# EAGLE design mLampMine (EAGLE 7.2.0)
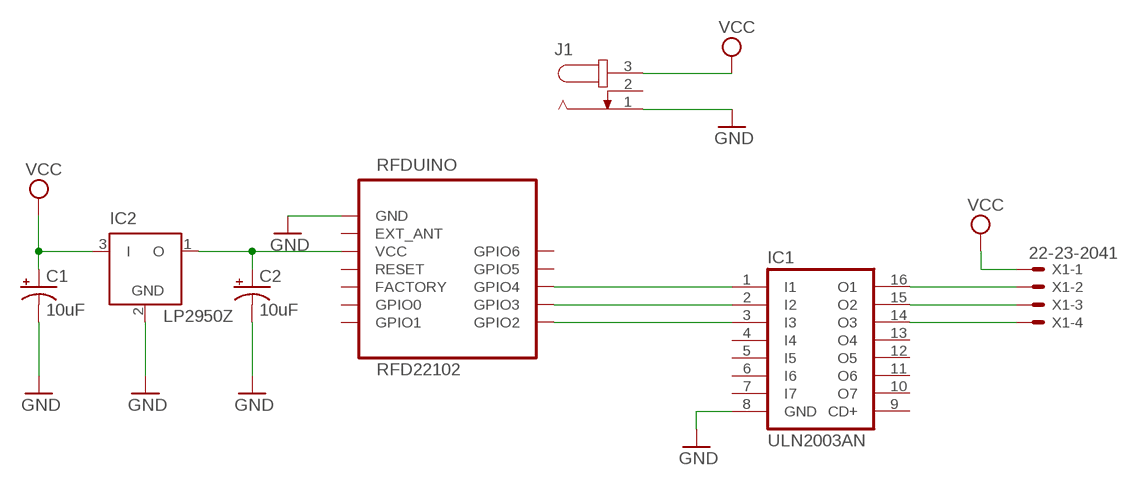
[diagram p0: schematic, sheet 1]

## Parts
C1  10uF  CAP_POLPTH2  [CPOL-RADIAL-10UF-25V]
C2  10uF  CAP_POLPTH2  [CPOL-RADIAL-10UF-25V]
IC1  ULN2003AN  [DIL16]
IC2  LP2950Z  [TO92]
J1  JACK-PLUG0  [SPC4077]
RFDUINO  RFD22102  [RFD22102]
X1  22-23-2041  [22-23-2041]

## Nets
GND: C1.2(-) C2.2(-) IC1.8(GND) IC2.2(GND) J1.1 RFDUINO.GND
N$1: IC1.2(I2) RFDUINO.GPIO3
N$2: IC1.1(I1) RFDUINO.GPIO4
N$3: IC1.3(I3) RFDUINO.GPIO2
N$4: C2.1(+) IC2.1(O) RFDUINO.VCC
N$5: IC1.14(O3) X1.4
N$6: IC1.15(O2) X1.3
N$7: IC1.16(O1) X1.2
VCC: C1.1(+) IC2.3(I) J1.3 X1.1
Unconnected: IC1.4(I4) IC1.5(I5) IC1.6(I6) IC1.7(I7) IC1.9(CD+) IC1.10(O7) IC1.11(O6) IC1.12(O5) IC1.13(O4) J1.2 RFDUINO.EXT_ANT RFDUINO.FACTORY RFDUINO.GPIO0 RFDUINO.GPIO1 RFDUINO.GPIO5 RFDUINO.GPIO6 RFDUINO.RESET

## Library data of the parts
C1 C2 = SparkFun-Capacitors:CAP_POL: Capacitor Polarized These are standard SMD and PTH capacitors. Normally 10uF, 47uF, and 100uF in electrolytic and tantalum varieties. Always verify the external diameter of the through hole cap, it varies with capacity, voltage, and manufacturer. The EIA devices should be standard.
IC1 = uln-udn:ULN2003A: DRIVER ARRAY
IC2 = linear:LP2950: 100 mA, Low Power Low Dropout Voltage Regulator Source: http://www.onsemi.com/pub/Collateral/LP2950-D.PDF
J1 = con-jack:JACK-PLUG: DC POWER JACK Power Jack, DC, Right Angle, Through Hole, Rated 5A at 16VDC, PC Terminals Distributor: Farnell (www.Farnell.de) Drawing: 84N1161.pdf / 84N1162.pdf Manufacturer: SPC Technology (www.spctechnology.com) Type: SPC4077 / SPC 4078; OC_FARNELL: unknown; OC_NEWARK: unknown
RFDUINO = RF_Digital_RFD22102_Eagle_Schematic_PCB_Library:RFD22102: RFD22102 RFduino DIP module RFduino Datasheet: http://www.rfdigital.com/wp-content/uploads/2014/03/rfduino.datasheet.pdf
X1 = con-molex:22-23-2041: .100" (2.54mm) Center Header - 4 Pin; MF: MOLEX; MPN: 22-23-2041; OC_FARNELL: 1462920; OC_NEWARK: 38C0355

## Board
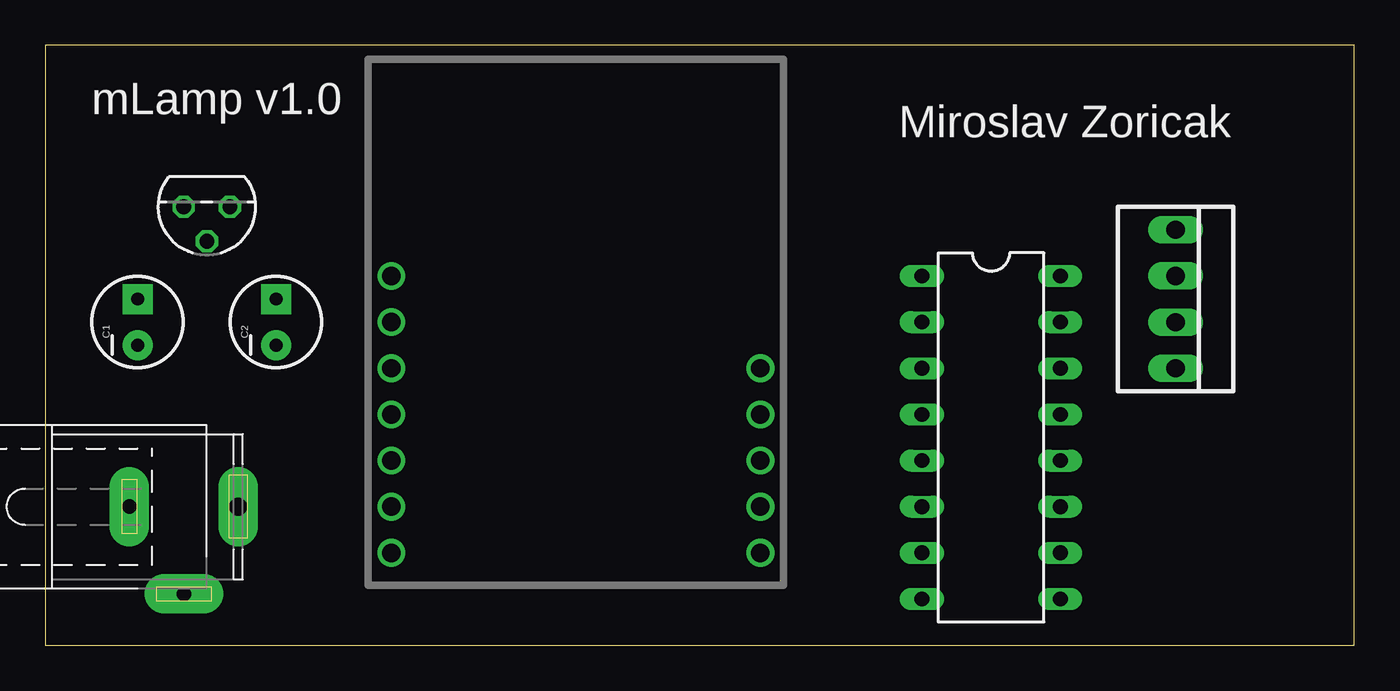
[diagram p1: board, top side]
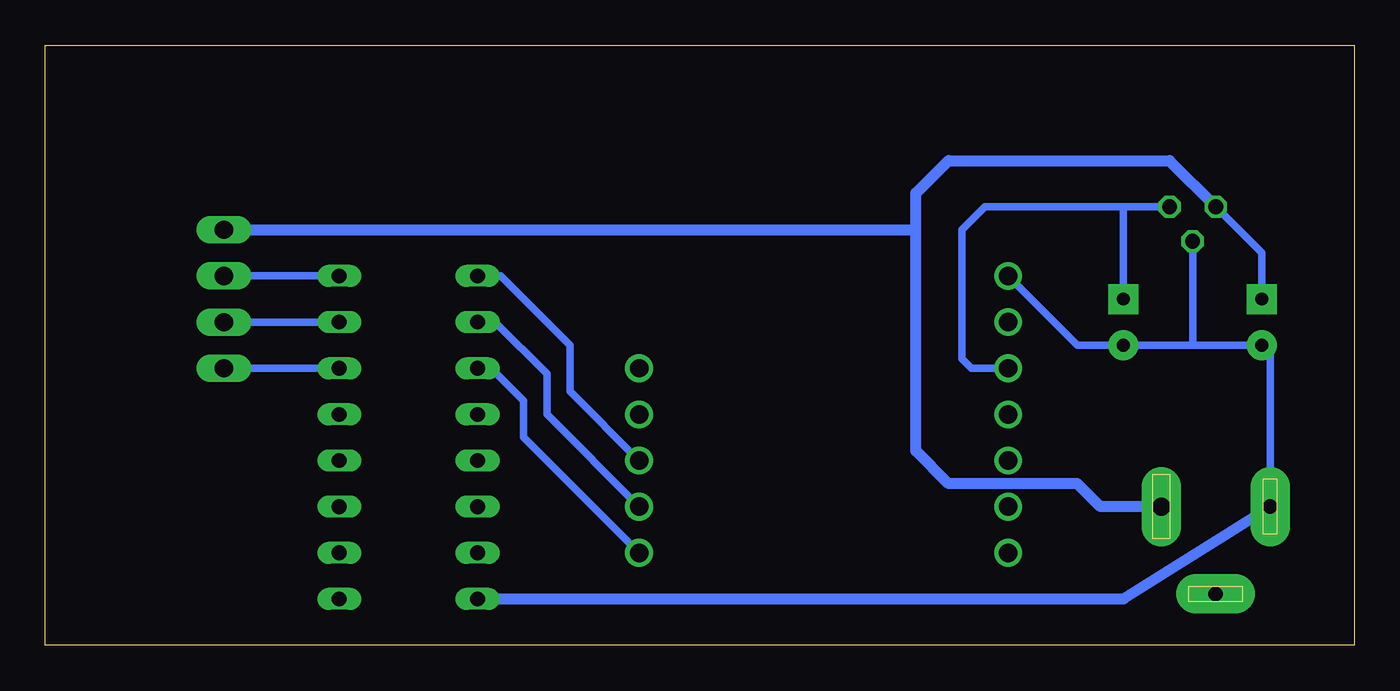
[diagram p2: board, bottom side, seen from below]

Size 72.06 x 33.01 mm. Coordinates in mm from the lower left corner, seen from the top.
Outline: 0,0 72.06,0 72.06,33.01 0,33.01 0,0
Copper layers (1*16): Top 0.0356mm / dielectric 1.5011mm / Bottom 0.0356mm
Design rules "LaenPCBOrder": minimum track width 6mil, minimum drill 13mil, track to track 6mil, track to pad 6mil, pad to pad 6mil, via to via 6mil, smd to smd 6mil, copper to edge 15mil, drill to drill 6mil, minimum pad ring 7mil, minimum via ring 7mil, stop-mask expansion 3mil, vias tented up to drill 0mil, thermal gap 10mil

### Footprints (pad centres in the part's own frame; a part is rotated, then mirrored left to right if it is on the bottom)
CPOL-RADIAL-10UF-25V = drill 0.7 pad 1.651 square: 1 1.27,0 | drill 0.7 pad 1.651: 2 -1.27,0
DIL16 = drill 0.813 long: 1 -8.89,-3.81; 2 -6.35,-3.81; 3 -3.81,-3.81; 4 -1.27,-3.81; 5 1.27,-3.81; 6 3.81,-3.81; 7 6.35,-3.81; 8 8.89,-3.81; 9 8.89,3.81; 10 6.35,3.81; 11 3.81,3.81; 12 1.27,3.81; 13 -1.27,3.81; 14 -3.81,3.81; 15 -6.35,3.81; 16 -8.89,3.81
TO92 = drill 0.813 octagon: 1 -1.27,0; 2 0,1.905; 3 1.27,0
SPC4077 = drill 0.8 pad 2.184 long: 1 -3,0; 2 0,-4.8 | drill 1 pad 2.184 long: 3 3,0
RFD22102 = drill 1.016: EXT_ANT -10.16,0; FACTORY -10.16,-7.62; GND -10.16,2.54; GPIO0 -10.16,-10.16; GPIO1 -10.16,-12.7; GPIO2 10.16,-12.7; GPIO3 10.16,-10.16; GPIO4 10.16,-7.62; GPIO5 10.16,-5.08; GPIO6 10.16,-2.54; RESET -10.16,-5.08; VCC -10.16,-2.54
22-23-2041 = drill 1 long: 1 -3.81,0; 2 -1.27,0; 3 1.27,0; 4 3.81,0

### Placement (x,y rotation side)
C1  5.08,17.78 90 top
C2  12.7,17.78 90 top
IC1  52.07,11.43 270 top
IC2  8.89,24.13 180 top
J1  7.62,7.62 0 top
RFDUINO  29.21,17.78 0 top
X1  62.23,19.05 270 top

### Tracks (layer width: path | path; a pad name or v marks a point on that pad's centre or on a via)
GND
  Bottom 0.406: J1.1 4.62,16.51 C1.2 8.89,16.51 | 8.89,16.51 C2.2 15.24,16.51 RFDUINO.GND | IC2.2 8.89,16.51
  Bottom 0.61: IC1.8 12.7,2.54 J1.1
N$1
  Bottom 0.406: RFDUINO.GPIO3 44.45,12.7 44.45,14.94 47.29,17.78 IC1.2
N$2
  Bottom 0.406: RFDUINO.GPIO4 43.18,13.97 43.18,16.51 46.99,20.32 IC1.1
N$3
  Bottom 0.406: RFDUINO.GPIO2 45.72,11.43 45.72,13.44 47.52,15.24 IC1.3
N$4
  Bottom 0.406: IC2.1 12.7,24.13 | 12.7,24.13 20.32,24.13 21.59,22.86 21.59,15.77 21.06,15.24 RFDUINO.VCC | C2.1 12.7,24.13
N$5
  Bottom 0.406: IC1.14 X1.4
N$6
  Bottom 0.406: IC1.15 X1.3
N$7
  Bottom 0.406: IC1.16 X1.2
VCC
  Bottom 0.406: C1.1 5.08,21.59 IC2.3
  Bottom 0.61: J1.3 13.97,7.62 15.24,8.89 22.33,8.89 24.13,10.69 24.13,22.86 | 24.13,22.86 24.13,24.87 22.33,26.67 10.16,26.67 IC2.3 | X1.1 24.13,22.86

### Text on the board
tNames: mLamp v1.0 | Miroslav Zoricak